# Altium project BtnDesignPro.PrjPCB
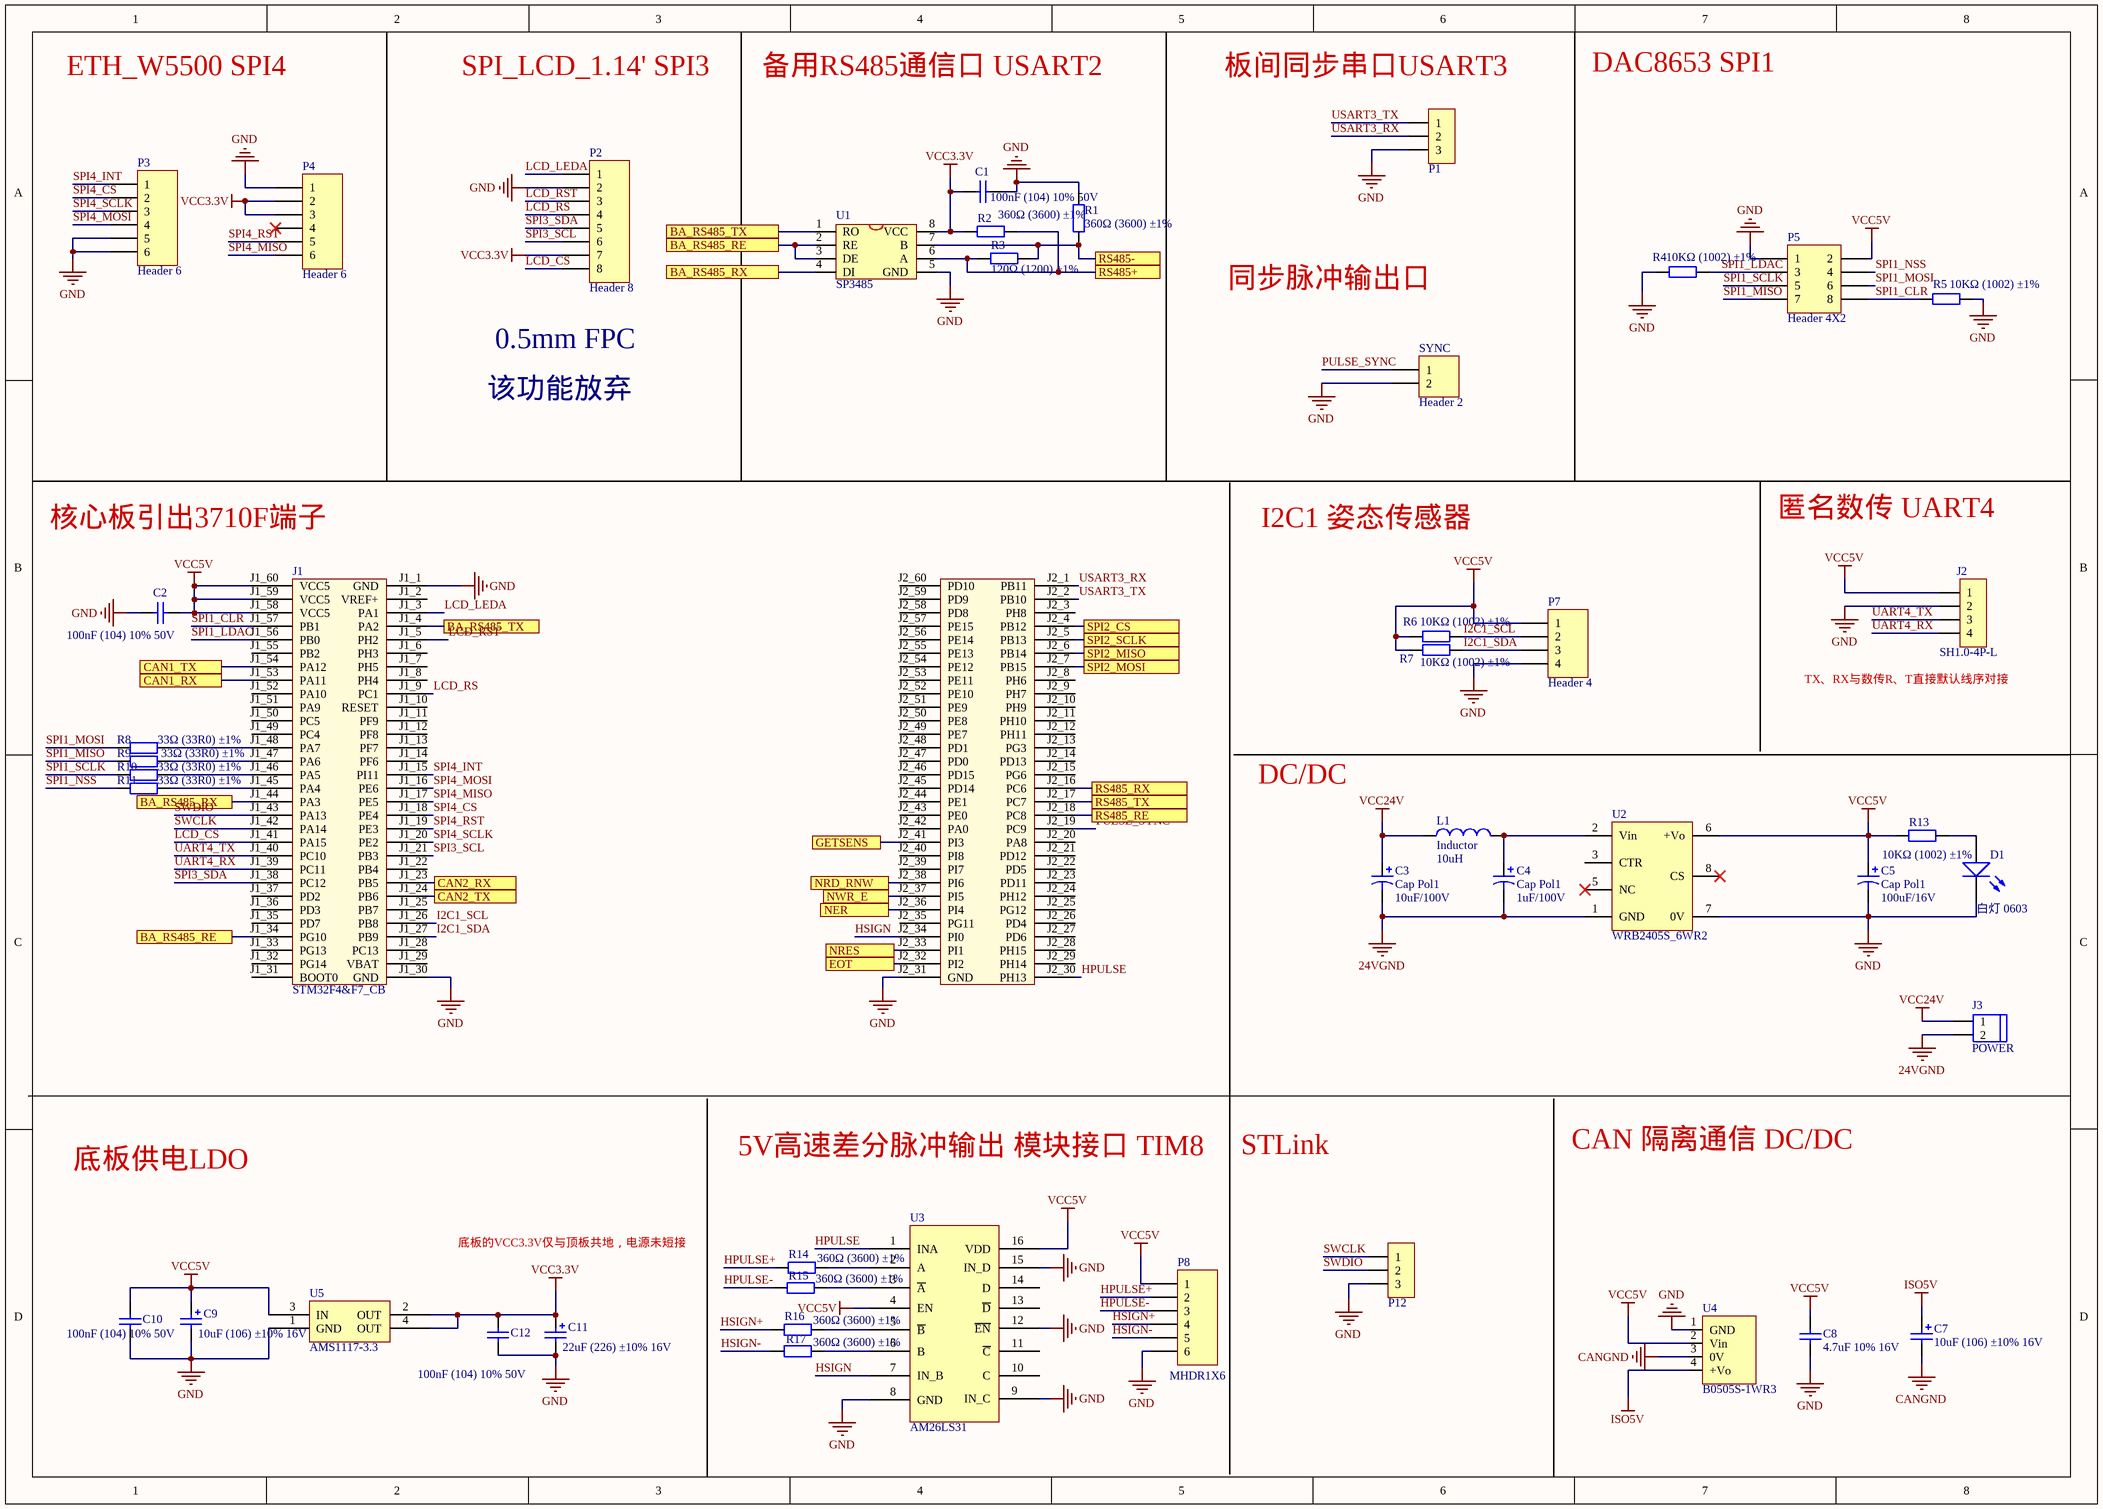
[diagram p0: BtnCore.SchDoc]
3 sheets, 78 parts. Net scope: flat (ports and power ports of the same name join across sheets).
Board file: BtnCore.PcbDoc
Sheets:
  BtnCore.SchDoc
  MagnetSensor.SchDoc
  CAN.SchDoc

## Sheet BtnCore.SchDoc
size A3

### Parts
C1  100nF (104) 10% 50V  [0402_C]
C2  100nF (104) 10% 50V  [0402_C]
C3  Cap Pol1  value 10uF/100V  [CAP-E8mm]
C4  Cap Pol1  value 1uF/100V  [CAP-E5mm]
C5  Cap Pol1  value 100uF/16V  [CAP-E8mm]
C7  10uF (106) ±10% 16V  [CASE-A_3216]
C8  4.7uF 10% 16V  [0603_C]
C9  10uF (106) ±10% 16V  [CASE-A_3216]
C10  100nF (104) 10% 50V  [0402_C]
C11  22uF (226) ±10% 16V  [CASE-B_3528]
C12  100nF (104) 10% 50V  [0402_C]
D1  白灯 0603  [0603_LED_S1]
J1  STM32F4&F7_CB  [STM32F4&F7_CB]
J2  SH1.0-4P-L  [SH1.0-4P-L]
J3  POWER  [HEAD2L-0.8]
L1  Inductor  value 10uH  [0603_L]
P1  SH1.0-3P  [SH1.0-3P-L]  (value not drawn)
P2  Header 8  [FPC0.5 2H-WS-8P]
P3  Header 6  [HDR1X6]
P4  Header 6  [HDR1X6]
P5  Header 4X2  [HDR2X4]
P7  Header 4  [SH1.0-4P-L]
P8  MHDR1X6  [SH1.0-6P-L]
P12  SH1.0-3P  [SH1.0-3P-L]  (value not drawn)
R1  360Ω (3600) ±1%  [0402_R]
R2  360Ω (3600) ±1%  [0402_R]
R3  120Ω (1200) ±1%  [0402_R]
R4  10KΩ (1002) ±1%  [0402_R]
R5  10KΩ (1002) ±1%  [0402_R]
R6  10KΩ (1002) ±1%  [0402_R]
R7  10KΩ (1002) ±1%  [0402_R]
R8  33Ω (33R0) ±1%  [0402_R]
R9  33Ω (33R0) ±1%  [0402_R]
R10  33Ω (33R0) ±1%  [0402_R]
R11  33Ω (33R0) ±1%  [0402_R]
R13  10KΩ (1002) ±1%  [0402_R]
R14  360Ω (3600) ±1%  [0402_R]
R15  360Ω (3600) ±1%  [0402_R]
R16  360Ω (3600) ±1%  [0402_R]
R17  360Ω (3600) ±1%  [0402_R]
SYNC  Header 2  [HDR1X2]
U1  SP3485  [SOP-8]
U2  WRB2405S_6WR2  [DCDC_SUCCEED-WRA_S/WRB-1/2/3W]
U3  AM26LS31  [SO-16_N]
U4  B0505S-1WR3  [B_S-1WR3]
U5  AMS1117-3.3  [SOT223_M]

### Ports
BA_RS485_RE, BA_RS485_RX, BA_RS485_TX, CAN1_RX, CAN1_TX, CAN2_RX, CAN2_TX, EOT, GETSENS, NER, NRD_RNW, NRES, NWR_E, RS485+, RS485-, RS485_RE, RS485_RX, RS485_TX, SPI2_CS, SPI2_MISO, SPI2_MOSI, SPI2_SCLK

### Nets
24VGND: C3.2 C4.2 J3.2 U2.1(GND)
CANGND: C7.2 U4.3(0V)
GND: C1.1 C2.1 C5.2 C8.2 C9.2 C10.2 C11.2 C12.2 D1.K J1.J1_1(GND) J1.J1_30(GND) J1.J2_31(GND) J2.2 P1.3 P2.2 P3.5 P3.6 P4.1 P5.1 P7.4 P8.6 P12.3 R1.2 R4.2 R5.1 SYNC.2 U1.5(GND) U2.7(0V) U3.8(GND) U3.9(IN_C) U3.12(~{EN}) U3.15(IN_D) U4.1(GND) U5.1(GND)
ISO5V: C7.1 U4.4(+Vo)
VCC3.3V: C1.2 C11.1 C12.1 P2.7 P4.2 P4.3 R2.1 U1.8(VCC) U5.2(OUT) U5.4(OUT)
VCC5V: C2.2 C5.1 C8.1 C9.1 C10.1 J1.J1_58(VCC5) J1.J1_59(VCC5) J1.J1_60(VCC5) J2.1 P5.2 P7.1 P8.1 R6.1 R7.1 R13.1 U2.6(+Vo) U3.4(EN) U3.16(VDD) U4.2(Vin) U5.3(IN)
VCC24V: C3.1 J3.1 L1.1
HPULSE: J1.J2_30(PH13) U3.1(INA)
HPULSE+: P8.2 R14.2
HPULSE-: P8.3 R15.2
HSIGN: J1.J2_34(PI0) U3.7(IN_B)
HSIGN+: P8.4 R16.2
HSIGN-: P8.5 R17.2
I2C1_SCL: J1.J1_26(PB8) P7.2 R6.2
I2C1_SDA: J1.J1_27(PB9) P7.3 R7.2
LCD_CS: J1.J1_41(PA15) P2.8
LCD_LEDA: J1.J1_3(PA1) P2.1
LCD_RS: J1.J1_9(PC1) P2.4
LCD_RST: J1.J1_5(PH2) P2.3
PULSE_SYNC: J1.J2_19(PC9) SYNC.1
SPI1_CLR: J1.J1_57(PB1) P5.8 R5.2
SPI1_LDAC: J1.J1_56(PB0) P5.3 R4.1
SPI1_MISO: P5.7 R9.1
SPI1_MOSI: P5.6 R8.1
SPI1_NSS: P5.4 R11.1
SPI1_SCLK: P5.5 R10.1
SPI3_SCL: J1.J1_21(PB3) P2.6
SPI3_SDA: J1.J1_38(PC12) P2.5
SPI4_CS: J1.J1_18(PE4) P3.2
SPI4_INT: J1.J1_15(PI11) P3.1
SPI4_MISO: J1.J1_17(PE5) P4.6
SPI4_MOSI: J1.J1_16(PE6) P3.4
SPI4_RST: J1.J1_19(PE3) P4.5
SPI4_SCLK: J1.J1_20(PE2) P3.3
SWCLK: J1.J1_42(PA14) P12.1
SWDIO: J1.J1_43(PA13) P12.2
UART4_RX: J1.J1_39(PC11) J2.4
UART4_TX: J1.J1_40(PC10) J2.3
USART3_RX: J1.J2_1(PB11) P1.2
USART3_TX: J1.J2_2(PB10) P1.1
NetC4_1: C4.1 L1.2 U2.2(Vin)
NetCAN1_4: R2.2 R3.2 U1.6(A) ; port RS485+
NetCAN1_5: R1.1 R3.1 U1.7(B) ; port RS485-
NetD1_A: D1.A R13.2
NetJ1_J1_4: J1.J1_4(PA2) U1.1(RO) ; port BA_RS485_TX
NetJ1_J1_23: J1.J1_23(PB5) ; port CAN2_RX
NetJ1_J1_24: J1.J1_24(PB6) ; port CAN2_TX
NetJ1_J1_34: J1.J1_34(PG10) U1.2(RE) U1.3(DE) ; port BA_RS485_RE
NetJ1_J1_44: J1.J1_44(PA3) U1.4(DI) ; port BA_RS485_RX
NetJ1_J1_45: J1.J1_45(PA4) R11.2
NetJ1_J1_46: J1.J1_46(PA5) R10.2
NetJ1_J1_47: J1.J1_47(PA6) R9.2
NetJ1_J1_48: J1.J1_48(PA7) R8.2
NetJ1_J1_53: J1.J1_53(PA11) ; port CAN1_RX
NetJ1_J1_54: J1.J1_54(PA12) ; port CAN1_TX
NetJ1_J2_4: J1.J2_4(PB12) ; port SPI2_CS
NetJ1_J2_5: J1.J2_5(PB13) ; port SPI2_SCLK
NetJ1_J2_6: J1.J2_6(PB14) ; port SPI2_MISO
NetJ1_J2_7: J1.J2_7(PB15) ; port SPI2_MOSI
NetJ1_J2_16: J1.J2_16(PC6) ; port RS485_RX
NetJ1_J2_17: J1.J2_17(PC7) ; port RS485_TX
NetJ1_J2_18: J1.J2_18(PC8) ; port RS485_RE
NetJ1_J2_32: J1.J2_32(PI2) ; port EOT
NetJ1_J2_33: J1.J2_33(PI1) ; port NRES
NetJ1_J2_36: J1.J2_36(PI4) ; port NER
NetJ1_J2_37: J1.J2_37(PI5) ; port NWR_E
NetJ1_J2_38: J1.J2_38(PI6) ; port NRD_RNW
NetJ1_J2_41: J1.J2_41(PI3) ; port GETSENS
NetR14_1: R14.1 U3.2(A)
NetR15_1: R15.1 U3.3(~{A})
NetR16_1: R16.1 U3.5(~{B})
NetR17_1: R17.1 U3.6(B)

Not connected (* = marked no-connect by the designer): J1 J1_2(VREF+) J1_6(PH3) J1_7(PH5) J1_8(PH4) J1_10(RESET) J1_11(PF9) J1_12(PF8) J1_13(PF7) J1_14(PF6) J1_22(PB4) J1_25(PB7) J1_28(PC13) J1_29(VBAT) J1_31(BOOT0) J1_32(PG14) J1_33(PG13) J1_35(PD7) J1_36(PD3) J1_37(PD2) J1_49(PC4) J1_50(PC5) J1_51(PA9) J1_52(PA10) J1_55(PB2) J2_3(PH8) J2_8(PH6) J2_9(PH7) J2_10(PH9) J2_11(PH10) J2_12(PH11) J2_13(PG3) J2_14(PD13) J2_15(PG6) J2_20(PA8) J2_21(PD12) J2_22(PD5) J2_23(PD11) J2_24(PH12) J2_25(PG12) J2_26(PD4) J2_27(PD6) J2_28(PH15) J2_29(PH14) J2_35(PG11) J2_39(PI7) J2_40(PI8) J2_42(PA0) J2_43(PE0) J2_44(PE1) J2_45(PD14) J2_46(PD15) J2_47(PD0) J2_48(PD1) J2_49(PE7) J2_50(PE8) J2_51(PE9) J2_52(PE10) J2_53(PE11) J2_54(PE12) J2_55(PE13) J2_56(PE14) J2_57(PE15) J2_58(PD8) J2_59(PD9) J2_60(PD10); P4 4*; U2 3(CTR) 5(NC)* 8(CS)*; U3 10(C) 11(~{C}) 13(~{D}) 14(D)

### Notes on the sheet
- ETH_W5500 SPI4
- SPI_LCD_1.14' SPI3
- 备用RS485通信口 USART2
- (near P1) 板间同步串口USART3
- DAC8653 SPI1
- 同步脉冲输出口
- 0.5mm FPC
- 该功能放弃
- 核心板引出3710F端子
- I2C1 姿态传感器
- 匿名数传 UART4
- TX、RX与数传R、T直接默认线序对接
- DC/DC
- 底板供电LDO
- 5V高速差分脉冲输出 模块接口 TIM8
- STLink
- CAN 隔离通信 DC/DC
- 底板的VCC3.3V仅与顶板共地，电源未短接

### Library data of the parts
C1 C2 C8 C10 C12 = 0603 100nF (104) 10% 50V: 贴片电容; ComponentLink1Description: 供应商链接; ComponentLink1URL: http://www.szlcsc.com/product/details_15331.html; Package: 0603; Supplier: LC; SuppliersPartNumber: C14663
C3-C5 = Cap Pol1: Polarized Capacitor (Radial); Published: 8-Jun-2000; LatestRevisionDate: 17-Jul-2002; LatestRevisionNote: Re-released for DXP Platform.; PackageReference: RB7.6-15; Publisher: Altium Limited; PackageDescription: Polarized Capacitor (Radial); 2 Leads
C7 C9 C11 = 3216 10uF (106) 10% 16V: 钽电容; ComponentLink1Description: 供应商链接; ComponentLink1URL: http://www.szlcsc.com/product/details_7643.html; Package: 3216; Supplier: LC; SuppliersPartNumber: C7171
D1 = 0603 白灯: 发光二极管; ComponentLink1Description: 供应商链接; ComponentLink1URL: http://www.szlcsc.com/product/details_2663.html; Package: 0603; Supplier: LC; SuppliersPartNumber: C2290
J1 = STM32F4&F7_CB: F429/746 Core Board
J2 = Header 4: 4P接插件; 厂商: JST; BOM名称: 4P接插件
J3 = HEAD2
L1 = Inductor: Code_IEC: 1005; Published: 8-Jun-2000; LatestRevisionDate: 29-May-2009; LatestRevisionNote: IPC-7351 Footprint Added.; PackageReference: 0402-A; Publisher: Altium Limited; PackageDescription: Chip Inductor; Code_JEITA: 0402
P1 P12 = Header 3: 3P接插件; 厂商: JST; BOM名称: 3P接插件
P2 = Header 8: Header, 8-Pin; LatestRevisionDate: 17-Jul-2002; LatestRevisionNote: Re-released for DXP Platform.; Publisher: Altium Limited
P3 P4 = Header 6: Header, 6-Pin; LatestRevisionDate: 17-Jul-2002; LatestRevisionNote: Re-released for DXP Platform.; Publisher: Altium Limited
P5 = Header 4X2: Header, 4-Pin, Dual row; LatestRevisionDate: 17-Jul-2002; LatestRevisionNote: Re-released for DXP Platform.; Publisher: Altium Limited
P7 = Header 4: Header, 4-Pin; LatestRevisionDate: 17-Jul-2002; LatestRevisionNote: Re-released for DXP Platform.; Publisher: Altium Limited
P8 = MHDR1X6: Header, 6-Pin; LatestRevisionDate: 17-Jul-2002; LatestRevisionNote: Re-released for DXP Platform.; Publisher: Altium Limited
R1 R2 R14-R17 = 0603 360Ω (3600) 1%: 贴片电阻; ComponentLink1Description: 供应商链接; ComponentLink1URL: http://www.szlcsc.com/product/details_25937.html; Package: 0603; Supplier: LC; SuppliersPartNumber: C25194
R3 = 0603 120Ω (1200) 1%: 贴片电阻; ComponentLink1Description: 供应商链接; ComponentLink1URL: http://www.szlcsc.com/product/details_23514.html; Package: 0603; Supplier: LC; SuppliersPartNumber: C22787
R4-R7 R13 = 0805 100KΩ (1003) 1%: 贴片电阻; ComponentLink1Description: 供应商链接; ComponentLink1URL: http://www.szlcsc.com/product/details_18095.html; Package: 0805; Supplier: LC; SuppliersPartNumber: C17407
R8-R11 = 0603 33Ω (33R0) 1%: 贴片电阻; ComponentLink1Description: 供应商链接; ComponentLink1URL: http://www.szlcsc.com/product/details_23867.html; Package: 0603; Supplier: LC; SuppliersPartNumber: C23140
SYNC = Header 2: Header, 2-Pin; LatestRevisionDate: 17-Jul-2002; LatestRevisionNote: Re-released for DXP Platform.; Publisher: Altium Limited
U1 = MAX3485
U2 = DCDC-WRB: 电源模块
U3 = AM26LS31: AM32LS31 单端转差分芯片
U4 = B_S-1WR3
U5 = AMS1117: 3.3V稳压芯片

## Sheet MagnetSensor.SchDoc
size A4
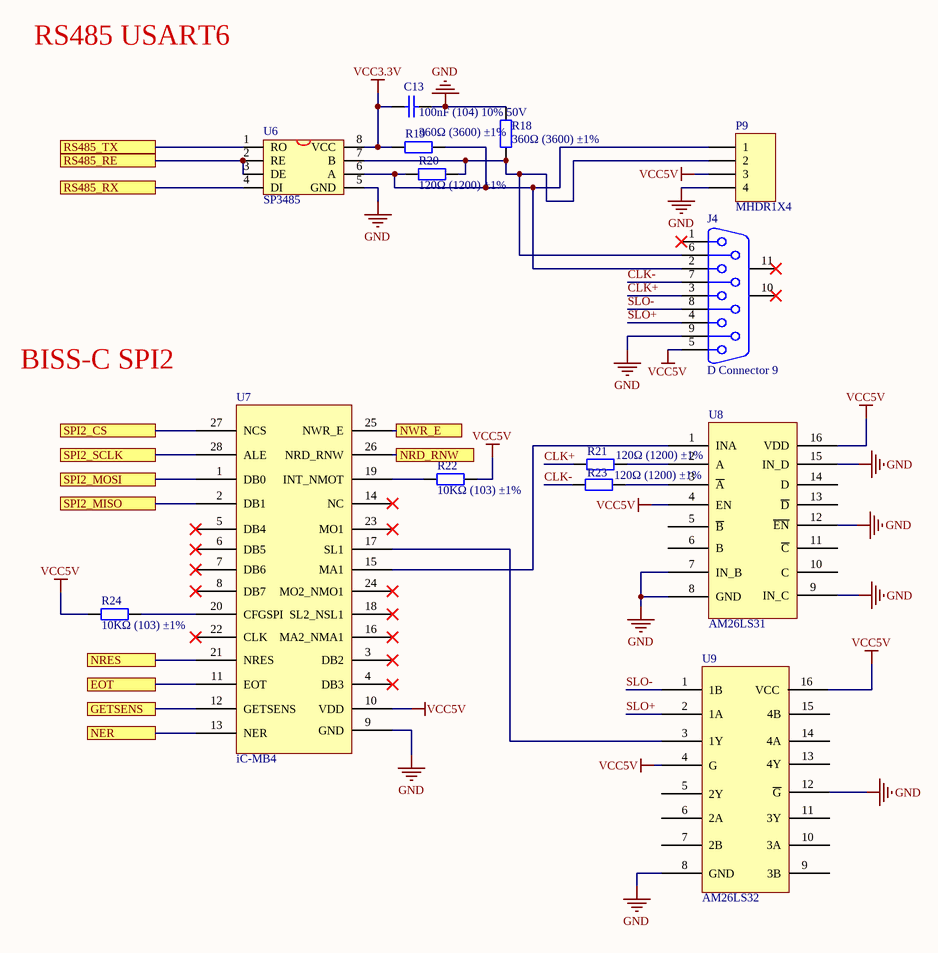
[diagram p1: MagnetSensor.SchDoc]

### Parts
C13  100nF (104) 10% 50V  [0402_C]
J4  D Connector 9  [DSUB1.385-2H9]
P9  MHDR1X4  [SH1.0-4P-L]
R18  360Ω (3600) ±1%  [0402_R]
R19  360Ω (3600) ±1%  [0402_R]
R20  120Ω (1200) ±1%  [0402_R]
R21  120Ω (1200) ±1%  [0402_R]
R22  10KΩ (103) ±1%  [0402_R]
R23  120Ω (1200) ±1%  [0402_R]
R24  10KΩ (103) ±1%  [0402_R]
U6  SP3485  [SOP-8]
U7  iC-MB4  [QFN-28_5x5x05P]
U8  AM26LS31  [SO-16_N]
U9  AM26LS32  [SO-16_N]

### Ports
EOT, GETSENS, NER, NRD_RNW, NRES, NWR_E, RS485_RE, RS485_RX, RS485_TX, SPI2_CS, SPI2_MISO, SPI2_MOSI, SPI2_SCLK

### Nets
GND: C13.1 J4.9 P9.4 R18.2 U6.5(GND) U7.9(GND) U8.7(IN_B) U8.8(GND) U8.9(IN_C) U8.12(~{EN}) U8.15(IN_D) U9.8(GND) U9.12(~{G})
VCC3.3V: C13.2 R19.1 U6.8(VCC)
VCC5V: J4.5 P9.3 R22.1 R24.2 U7.10(VDD) U8.4(EN) U8.16(VDD) U9.4(G) U9.16(VCC)
CLK+: J4.3 R21.2
CLK-: J4.7 R23.2
SLO+: J4.4 U9.2(1A)
SLO-: J4.8 U9.1(1B)
NetJ1_J2_4: U7.27(NCS) ; port SPI2_CS
NetJ1_J2_5: U7.28(ALE) ; port SPI2_SCLK
NetJ1_J2_6: U7.2(DB1) ; port SPI2_MISO
NetJ1_J2_7: U7.1(DB0) ; port SPI2_MOSI
NetJ1_J2_16: U6.4(DI) ; port RS485_RX
NetJ1_J2_17: U6.1(RO) ; port RS485_TX
NetJ1_J2_18: U6.2(RE) U6.3(DE) ; port RS485_RE
NetJ1_J2_32: U7.11(EOT) ; port EOT
NetJ1_J2_33: U7.21(NRES) ; port NRES
NetJ1_J2_36: U7.13(NER) ; port NER
NetJ1_J2_37: U7.25(NWR_E) ; port NWR_E
NetJ1_J2_38: U7.26(NRD_RNW) ; port NRD_RNW
NetJ1_J2_41: U7.12(GETSENS) ; port GETSENS
NetJ4_2: J4.2 P9.1 R19.2 R20.2 U6.6(A)
NetJ4_6: J4.6 P9.2 R18.1 R20.1 U6.7(B)
NetR21_1: R21.1 U8.2(A)
NetR22_2: R22.2 U7.19(INT_NMOT)
NetR23_1: R23.1 U8.3(~{A})
NetR24_1: R24.1 U7.20(CFGSPI)
NetU7_15: U7.15(MA1) U8.1(INA)
NetU7_17: U7.17(SL1) U9.3(1Y)

Not connected (* = marked no-connect by the designer): J4 1* 10(MH1)* 11(MH2)*; U7 3(DB2)* 4(DB3)* 5(DB4)* 6(DB5)* 7(DB6)* 8(DB7)* 14(NC)* 16(MA2_NMA1)* 18(SL2_NSL1)* 22(CLK)* 23(MO1)* 24(MO2_NMO1)*; U8 5(~{B}) 6(B) 10(C) 11(~{C}) 13(~{D}) 14(D); U9 5(2Y) 6(2A) 7(2B) 9(3B) 10(3A) 11(3Y) 13(4Y) 14(4A) 15(4B)

### Notes on the sheet
- RS485 USART6
- BISS-C SPI2

### Library data of the parts
C13 = 0603 100nF (104) 10% 50V: 贴片电容; ComponentLink1Description: 供应商链接; ComponentLink1URL: http://www.szlcsc.com/product/details_15331.html; Package: 0603; Supplier: LC; SuppliersPartNumber: C14663
J4 = D Connector 9: Receptacle Assembly, 9 Position, Right Angle; PackageDocument: O; Positions: 9; Published: 15-Jun-2001; LatestRevisionDate: 17-Jul-2002; LatestRevisionNote: Re-released for DXP Platform.; DatasheetDocument: 1-Sep-1999; PackageReference: 788750; Publisher: Altium Limited; Orientation: Right Angle; Gender: Receptacle
P9 = MHDR1X4: Header, 4-Pin; LatestRevisionDate: 17-Jul-2002; LatestRevisionNote: Re-released for DXP Platform.; Publisher: Altium Limited
R18 R19 R21-R24 = 0603 360Ω (3600) 1%: 贴片电阻; ComponentLink1Description: 供应商链接; ComponentLink1URL: http://www.szlcsc.com/product/details_25937.html; Package: 0603; Supplier: LC; SuppliersPartNumber: C25194
R20 = 0603 120Ω (1200) 1%: 贴片电阻; ComponentLink1Description: 供应商链接; ComponentLink1URL: http://www.szlcsc.com/product/details_23514.html; Package: 0603; Supplier: LC; SuppliersPartNumber: C22787
U6 = MAX3485
U7 = iC-MB4: SPI转BiSS主站芯片
U8 = AM26LS31: AM32LS31 单端转差分芯片
U9 = AM26LS32: AM26LS32 差分转单端

## Sheet CAN.SchDoc
size A4
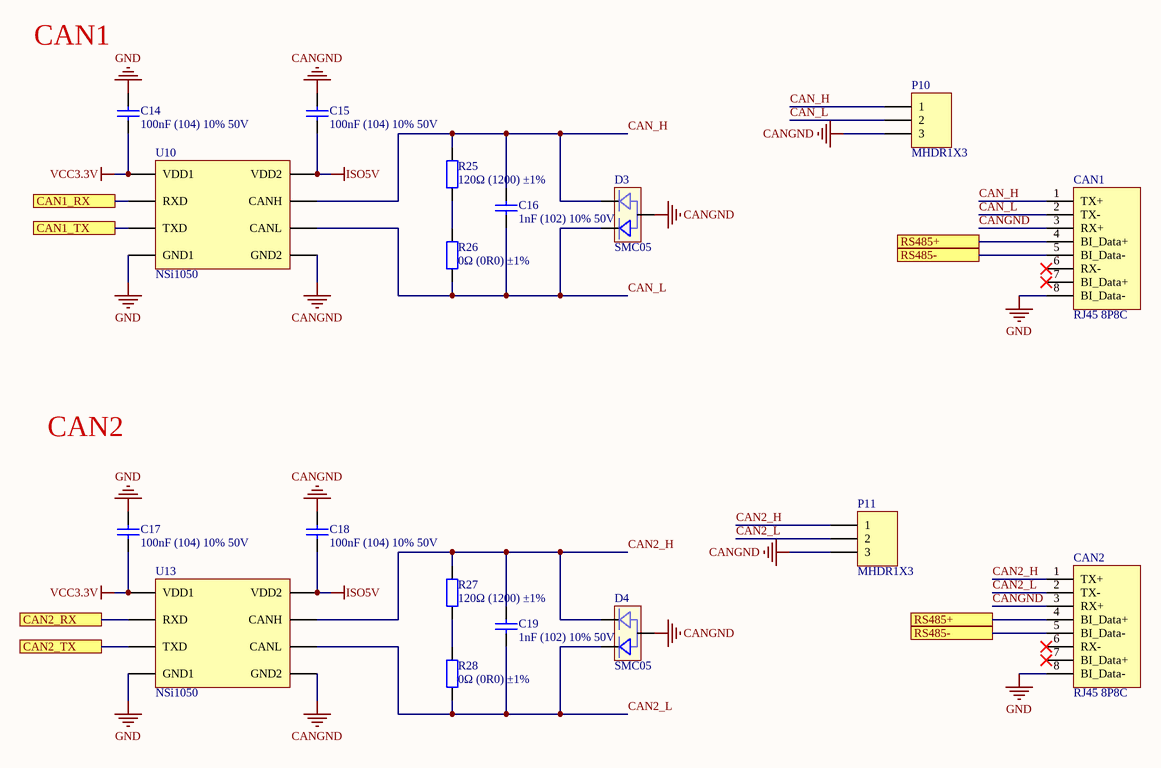
[diagram p2: CAN.SchDoc]

### Parts
C14  100nF (104) 10% 50V  [0402_C]
C15  100nF (104) 10% 50V  [0402_C]
C16  1nF (102) 10% 50V  [0402_C]
C17  100nF (104) 10% 50V  [0402_C]
C18  100nF (104) 10% 50V  [0402_C]
C19  1nF (102) 10% 50V  [0402_C]
CAN1  RJ45 8P8C  [RJ45-8P8C]
CAN2  RJ45 8P8C  [RJ45-8P8C]
D3  SMC05  [SOT-23]
D4  SMC05  [SOT-23]
P10  MHDR1X3  [SH1.0-3P-L]
P11  MHDR1X3  [SH1.0-3P-L]
R25  120Ω (1200) ±1%  [0402_R]
R26  0Ω (0R0) ±1%  [0402_R]
R27  120Ω (1200) ±1%  [0402_R]
R28  0Ω (0R0) ±1%  [0402_R]
U10  NSi1050  [SOP8-W2.54]
U13  NSi1050  [SOP8-W2.54]

### Ports
CAN1_RX, CAN1_TX, CAN2_RX, CAN2_TX, RS485+, RS485-

### Nets
CANGND: C15.1 C18.1 CAN1.3(RX+) CAN2.3(RX+) D3.3 D4.3 P10.3 P11.3 U10.5(GND2) U13.5(GND2)
GND: C14.1 C17.1 CAN1.8(BI_Data-) CAN2.8(BI_Data-) U10.4(GND1) U13.4(GND1)
ISO5V: C15.2 C18.2 U10.8(VDD2) U13.8(VDD2)
VCC3.3V: C14.2 C17.2 U10.1(VDD1) U13.1(VDD1)
CAN2_H: C19.2 CAN2.1(TX+) D4.1 P11.1 R27.2 U13.7(CANH)
CAN2_L: C19.1 CAN2.2(TX-) D4.2 P11.2 R28.1 U13.6(CANL)
CAN_H: C16.2 CAN1.1(TX+) D3.1 P10.1 R25.2 U10.7(CANH)
CAN_L: C16.1 CAN1.2(TX-) D3.2 P10.2 R26.1 U10.6(CANL)
NetCAN1_4: CAN1.4(BI_Data+) CAN2.4(BI_Data+) ; port RS485+
NetCAN1_5: CAN1.5(BI_Data-) CAN2.5(BI_Data-) ; port RS485-
NetJ1_J1_23: U13.2(RXD) ; port CAN2_RX
NetJ1_J1_24: U13.3(TXD) ; port CAN2_TX
NetJ1_J1_53: U10.2(RXD) ; port CAN1_RX
NetJ1_J1_54: U10.3(TXD) ; port CAN1_TX
NetR25_1: R25.1 R26.2
NetR27_1: R27.1 R28.2

Not connected (* = marked no-connect by the designer): CAN1 6(RX-)* 7(BI_Data+)*; CAN2 6(RX-)* 7(BI_Data+)*

### Notes on the sheet
- CAN1
- CAN2

### Library data of the parts
C14 C15 C17 C18 = 0603 100nF (104) 10% 50V: 贴片电容; ComponentLink1Description: 供应商链接; ComponentLink1URL: http://www.szlcsc.com/product/details_15331.html; Package: 0603; Supplier: LC; SuppliersPartNumber: C14663
C16 C19 = 0603 1nF (102) 10% 50V: 贴片电容; ComponentLink1Description: 供应商链接; ComponentLink1URL: http://www.szlcsc.com/product/details_1940.html; Package: 0603; Supplier: LC; SuppliersPartNumber: C1588
CAN1 CAN2 = RJ45-8P8C: 以太网接口
D3 D4 = Diode-TVS: 瞬态抑制二极管
P10 P11 = MHDR1X3: Header, 3-Pin; LatestRevisionDate: 17-Jul-2002; LatestRevisionNote: Re-released for DXP Platform.; Publisher: Altium Limited
R25 R27 = 0603 120Ω (1200) 1%: 贴片电阻; ComponentLink1Description: 供应商链接; ComponentLink1URL: http://www.szlcsc.com/product/details_23514.html; Package: 0603; Supplier: LC; SuppliersPartNumber: C22787
R26 R28 = 0603 0Ω (0R0) 1%: 贴片电阻; ComponentLink1Description: 供应商链接; ComponentLink1URL: http://www.szlcsc.com/product/details_21903.html; Package: 0603; Supplier: LC; SuppliersPartNumber: C21189
U10 U13 = NSi1050: CAN隔离收发器

## Nets that join several sheets
CANGND: BtnCore (C7.2 U4.3), CAN (10 pins)
GND: BtnCore (34 pins), MagnetSensor (13 pins), CAN (6 pins)
ISO5V: BtnCore (C7.1 U4.4), CAN (C15.2 C18.2 U10.8 U13.8)
VCC3.3V: BtnCore (10 pins), MagnetSensor (C13.2 R19.1 U6.8), CAN (C14.2 C17.2 U10.1 U13.1)
VCC5V: BtnCore (20 pins), MagnetSensor (9 pins)
NetCAN1_4: BtnCore (R2.2 R3.2 U1.6), CAN (CAN1.4 CAN2.4)
NetCAN1_5: BtnCore (R1.1 R3.1 U1.7), CAN (CAN1.5 CAN2.5)
NetJ1_J1_23: BtnCore (J1.J1_23), CAN (U13.2)
NetJ1_J1_24: BtnCore (J1.J1_24), CAN (U13.3)
NetJ1_J1_53: BtnCore (J1.J1_53), CAN (U10.2)
NetJ1_J1_54: BtnCore (J1.J1_54), CAN (U10.3)
NetJ1_J2_4: BtnCore (J1.J2_4), MagnetSensor (U7.27)
NetJ1_J2_5: BtnCore (J1.J2_5), MagnetSensor (U7.28)
NetJ1_J2_6: BtnCore (J1.J2_6), MagnetSensor (U7.2)
NetJ1_J2_7: BtnCore (J1.J2_7), MagnetSensor (U7.1)
NetJ1_J2_16: BtnCore (J1.J2_16), MagnetSensor (U6.4)
NetJ1_J2_17: BtnCore (J1.J2_17), MagnetSensor (U6.1)
NetJ1_J2_18: BtnCore (J1.J2_18), MagnetSensor (U6.2 U6.3)
NetJ1_J2_32: BtnCore (J1.J2_32), MagnetSensor (U7.11)
NetJ1_J2_33: BtnCore (J1.J2_33), MagnetSensor (U7.21)
NetJ1_J2_36: BtnCore (J1.J2_36), MagnetSensor (U7.13)
NetJ1_J2_37: BtnCore (J1.J2_37), MagnetSensor (U7.25)
NetJ1_J2_38: BtnCore (J1.J2_38), MagnetSensor (U7.26)
NetJ1_J2_41: BtnCore (J1.J2_41), MagnetSensor (U7.12)